# Altium schematic sheet Sheet3.SchDoc
size A3
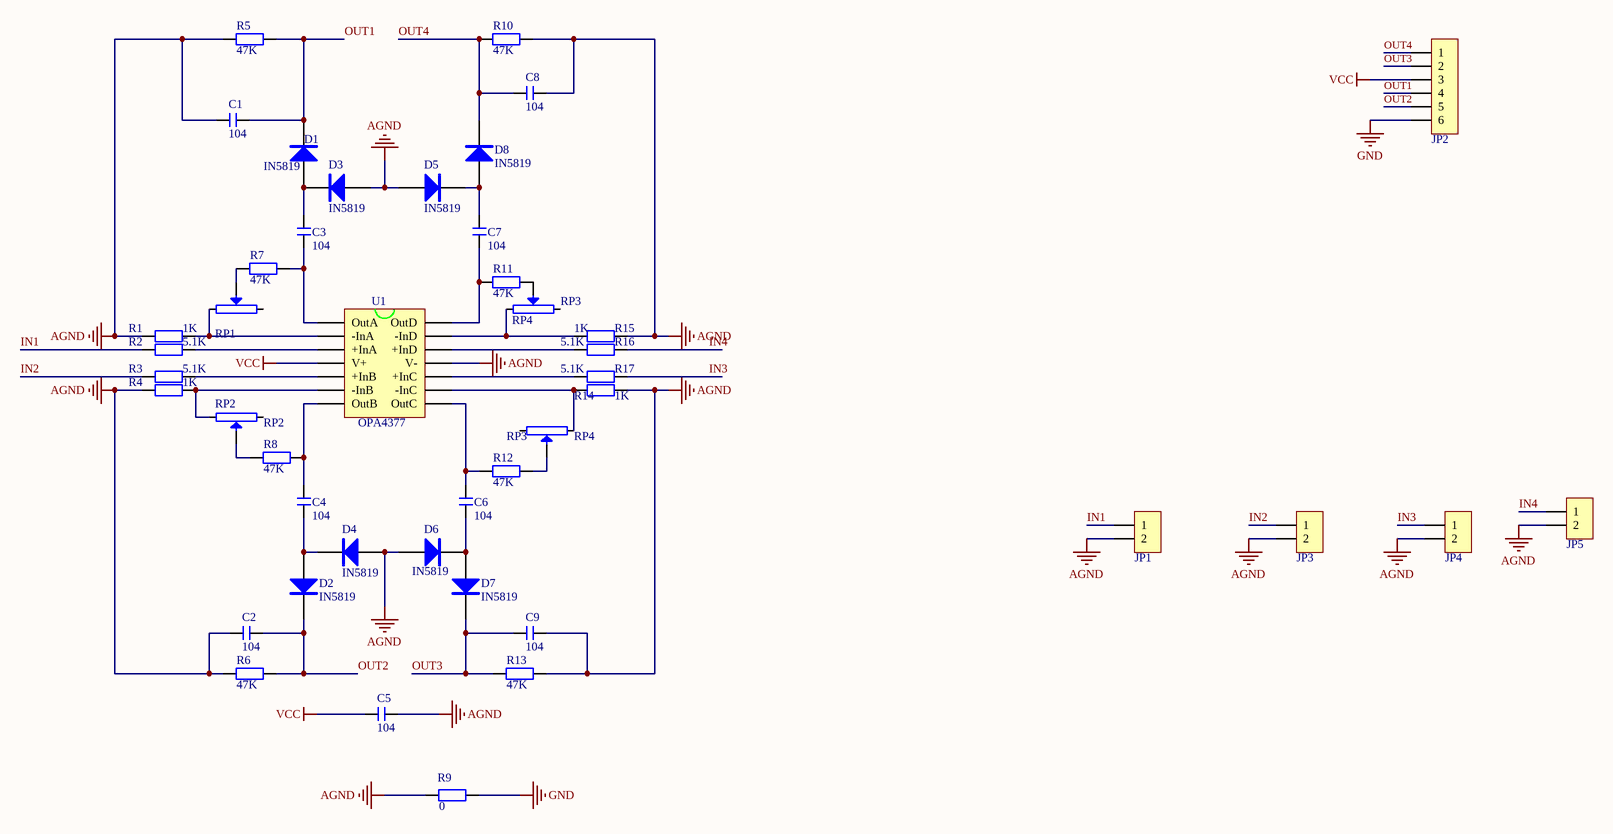
[diagram p0: Sheet3.SchDoc]

## Parts
C1  104  [R 0805_M]
C2  104  [R 0805_M]
C3  104  [R 0805_M]
C4  104  [R 0805_M]
C5  104  [R 0805_M]
C6  104  [R 0805_M]
C7  104  [R 0805_M]
C8  104  [R 0805_M]
C9  104  [R 0805_M]
D1  IN5819  [SOD-123]
D2  IN5819  [SOD-123]
D3  IN5819  [SOD-123]
D4  IN5819  [SOD-123]
D5  IN5819  [SOD-123]
D6  IN5819  [SOD-123]
D7  IN5819  [SOD-123]
D8  IN5819  [SOD-123]
JP1  HDR-1X2  [XH2.54-LI-2P]  (value not drawn)
JP2  HDR-1X6  [HDR2.54-LI-6P]  (value not drawn)
JP3  HDR-1X2  [XH2.54-LI-2P]  (value not drawn)
JP4  HDR-1X2  [XH2.54-LI-2P]  (value not drawn)
JP5  HDR-1X2  [XH2.54-LI-2P]  (value not drawn)
R1  1K  [R 0805_M]
R2  5.1K  [R 0805_M]
R3  5.1K  [R 0805_M]
R4  1K  [R 0805_M]
R5  47K  [R 0805_M]
R6  47K  [R 0805_M]
R7  47K  [R 0805_M]
R8  47K  [R 0805_M]
R9  0  [14-1210]
R10  47K  [R 0805_M]
R11  47K  [R 0805_M]
R12  47K  [R 0805_M]
R13  47K  [R 0805_M]
R14  1K  [R 0805_M]
R15  1K  [R 0805_M]
R16  5.1K  [R 0805_M]
R17  5.1K  [R 0805_M]
RP1  RP1  [3269W_滑动变阻器]
RP2  RP2  [3269W_滑动变阻器]
RP3  RP4  [3269W_滑动变阻器]
RP4  RP3  [3269W_滑动变阻器]
U1  OPA4377  [PCBComponent_1]

## Nets
AGND: C1.1 C2.1 C5.2 C8.2 C9.2 D3.1 D4.1 D5.1 D6.1 JP1.2 JP3.2 JP4.2 JP5.2 R1.1 R4.1 R5.1 R6.1 R9.2 R10.2 R13.2 R14.2 R15.2 U1.11(V-)
GND: JP2.6 R9.1(vcc)
VCC: C5.1 JP2.3 U1.4(V+)
IN1: JP1.1 R2.1
IN2: JP3.1 R3.1
IN3: JP4.1 R17.2
IN4: JP5.1 R16.2
OUT1: C1.2 D1.2 JP2.4 R5.2
OUT2: C2.2 D2.2 JP2.5 R6.2
OUT3: C9.1 D7.2 JP2.2 R13.1
OUT4: C8.1 D8.2 JP2.1 R10.1
NetC3_1: C3.1 R7.2 U1.1(OutA)
NetC3_2: C3.2 D1.1 D3.2
NetC4_1: C4.1 D2.1 D4.2
NetC4_2: C4.2 R8.2 U1.7(OutB)
NetC6_1: C6.1 D6.2 D7.1
NetC6_2: C6.2 R12.1 U1.8(OutC)
NetC7_1: C7.1 R11.1 U1.14(OutD)
NetC7_2: C7.2 D5.2 D8.1
NetR1_2: R1.2 RP1.1 U1.2(-InA)
NetR2_2: R2.2 U1.3(+InA)
NetR3_2: R3.2 U1.5(+InB)
NetR4_2: R4.2 RP2.2 U1.6(-InB)
NetR7_1: R7.1 RP1.3
NetR8_1: R8.1 RP2.3
NetR11_2: R11.2 RP4.3
NetR12_2: R12.2 RP3.3
NetR14_1: R14.1 RP3.1 U1.9(-InC)
NetR15_1: R15.1 RP4.1 U1.13(-InD)
NetR16_1: R16.1 U1.12(+InD)
NetR17_1: R17.1 U1.10(+InC)

Not connected (* = marked no-connect by the designer): RP1 2; RP2 1; RP3 2; RP4 2

## Library data of the parts
C1-C9 = C: 贴片电容; BOM名称: 无极性贴片电容; 淘宝ID: 封装库来自淘宝 ID：黄晶宝石; 联系售后，技术支持: https://shop463601444.taobao.com; 唯一出售店铺网址: https://shop463601444.taobao.com
JP1 JP3-JP5 = Header 2: 2P接插件; 版权归属: 封装库来自淘宝 ID：黄晶宝石; BOM名称: 2P接插件; 联系售后: https://shop463601444.taobao.com
JP2 = Header 6: 6P接插件; 版权归属: 源创客; BOM名称: 6P接插件; 学习资源: www.ooocke.com
R1 = R1: Resistor; Published: 8-Jun-2000; LatestRevisionDate: 17-Jul-2002; LatestRevisionNote: Re-released for DXP Platform.; PackageReference: AXIAL-0.4; Publisher: Altium Limited; PackageDescription: Axial Device, Thru-Hole; 2 Leads; 0.4 in Pin Spacing
R2 = R13: Resistor; Published: 8-Jun-2000; LatestRevisionDate: 17-Jul-2002; LatestRevisionNote: Re-released for DXP Platform.; PackageReference: AXIAL-0.4; Publisher: Altium Limited; PackageDescription: Axial Device, Thru-Hole; 2 Leads; 0.4 in Pin Spacing
R3 = R14: Resistor; Published: 8-Jun-2000; LatestRevisionDate: 17-Jul-2002; LatestRevisionNote: Re-released for DXP Platform.; PackageReference: AXIAL-0.4; Publisher: Altium Limited; PackageDescription: Axial Device, Thru-Hole; 2 Leads; 0.4 in Pin Spacing
R4 = R2: Resistor; Published: 8-Jun-2000; LatestRevisionDate: 17-Jul-2002; LatestRevisionNote: Re-released for DXP Platform.; PackageReference: AXIAL-0.4; Publisher: Altium Limited; PackageDescription: Axial Device, Thru-Hole; 2 Leads; 0.4 in Pin Spacing
R5 = R9: Resistor; Published: 8-Jun-2000; LatestRevisionDate: 17-Jul-2002; LatestRevisionNote: Re-released for DXP Platform.; PackageReference: AXIAL-0.4; Publisher: Altium Limited; PackageDescription: Axial Device, Thru-Hole; 2 Leads; 0.4 in Pin Spacing
R6 = R10: Resistor; Published: 8-Jun-2000; LatestRevisionDate: 17-Jul-2002; LatestRevisionNote: Re-released for DXP Platform.; PackageReference: AXIAL-0.4; Publisher: Altium Limited; PackageDescription: Axial Device, Thru-Hole; 2 Leads; 0.4 in Pin Spacing
R7 = R5: Resistor; Published: 8-Jun-2000; LatestRevisionDate: 17-Jul-2002; LatestRevisionNote: Re-released for DXP Platform.; PackageReference: AXIAL-0.4; Publisher: Altium Limited; PackageDescription: Axial Device, Thru-Hole; 2 Leads; 0.4 in Pin Spacing
R8 = R6: Resistor; Published: 8-Jun-2000; LatestRevisionDate: 17-Jul-2002; LatestRevisionNote: Re-released for DXP Platform.; PackageReference: AXIAL-0.4; Publisher: Altium Limited; PackageDescription: Axial Device, Thru-Hole; 2 Leads; 0.4 in Pin Spacing
R9 = RES_MD
R10 = R12: Resistor; Published: 8-Jun-2000; LatestRevisionDate: 17-Jul-2002; LatestRevisionNote: Re-released for DXP Platform.; PackageReference: AXIAL-0.4; Publisher: Altium Limited; PackageDescription: Axial Device, Thru-Hole; 2 Leads; 0.4 in Pin Spacing
R11 = R8: Resistor; Published: 8-Jun-2000; LatestRevisionDate: 17-Jul-2002; LatestRevisionNote: Re-released for DXP Platform.; PackageReference: AXIAL-0.4; Publisher: Altium Limited; PackageDescription: Axial Device, Thru-Hole; 2 Leads; 0.4 in Pin Spacing
R12 = R7: Resistor; Published: 8-Jun-2000; LatestRevisionDate: 17-Jul-2002; LatestRevisionNote: Re-released for DXP Platform.; PackageReference: AXIAL-0.4; Publisher: Altium Limited; PackageDescription: Axial Device, Thru-Hole; 2 Leads; 0.4 in Pin Spacing
R13 = R11: Resistor; Published: 8-Jun-2000; LatestRevisionDate: 17-Jul-2002; LatestRevisionNote: Re-released for DXP Platform.; PackageReference: AXIAL-0.4; Publisher: Altium Limited; PackageDescription: Axial Device, Thru-Hole; 2 Leads; 0.4 in Pin Spacing
R14 = R3: Resistor; Published: 8-Jun-2000; LatestRevisionDate: 17-Jul-2002; LatestRevisionNote: Re-released for DXP Platform.; PackageReference: AXIAL-0.4; Publisher: Altium Limited; PackageDescription: Axial Device, Thru-Hole; 2 Leads; 0.4 in Pin Spacing
R15 = R4: Resistor; Published: 8-Jun-2000; LatestRevisionDate: 17-Jul-2002; LatestRevisionNote: Re-released for DXP Platform.; PackageReference: AXIAL-0.4; Publisher: Altium Limited; PackageDescription: Axial Device, Thru-Hole; 2 Leads; 0.4 in Pin Spacing
R16 = R16: Resistor; Published: 8-Jun-2000; LatestRevisionDate: 17-Jul-2002; LatestRevisionNote: Re-released for DXP Platform.; PackageReference: AXIAL-0.4; Publisher: Altium Limited; PackageDescription: Axial Device, Thru-Hole; 2 Leads; 0.4 in Pin Spacing
R17 = R15: Resistor; Published: 8-Jun-2000; LatestRevisionDate: 17-Jul-2002; LatestRevisionNote: Re-released for DXP Platform.; PackageReference: AXIAL-0.4; Publisher: Altium Limited; PackageDescription: Axial Device, Thru-Hole; 2 Leads; 0.4 in Pin Spacing
RP3 = RP3
RP4 = RP4